# Altium schematic sheet obc-v2_CM4-POWER.SchDoc
size 420 x 297 mm; SheetNumber: 21; SheetTotal: 23
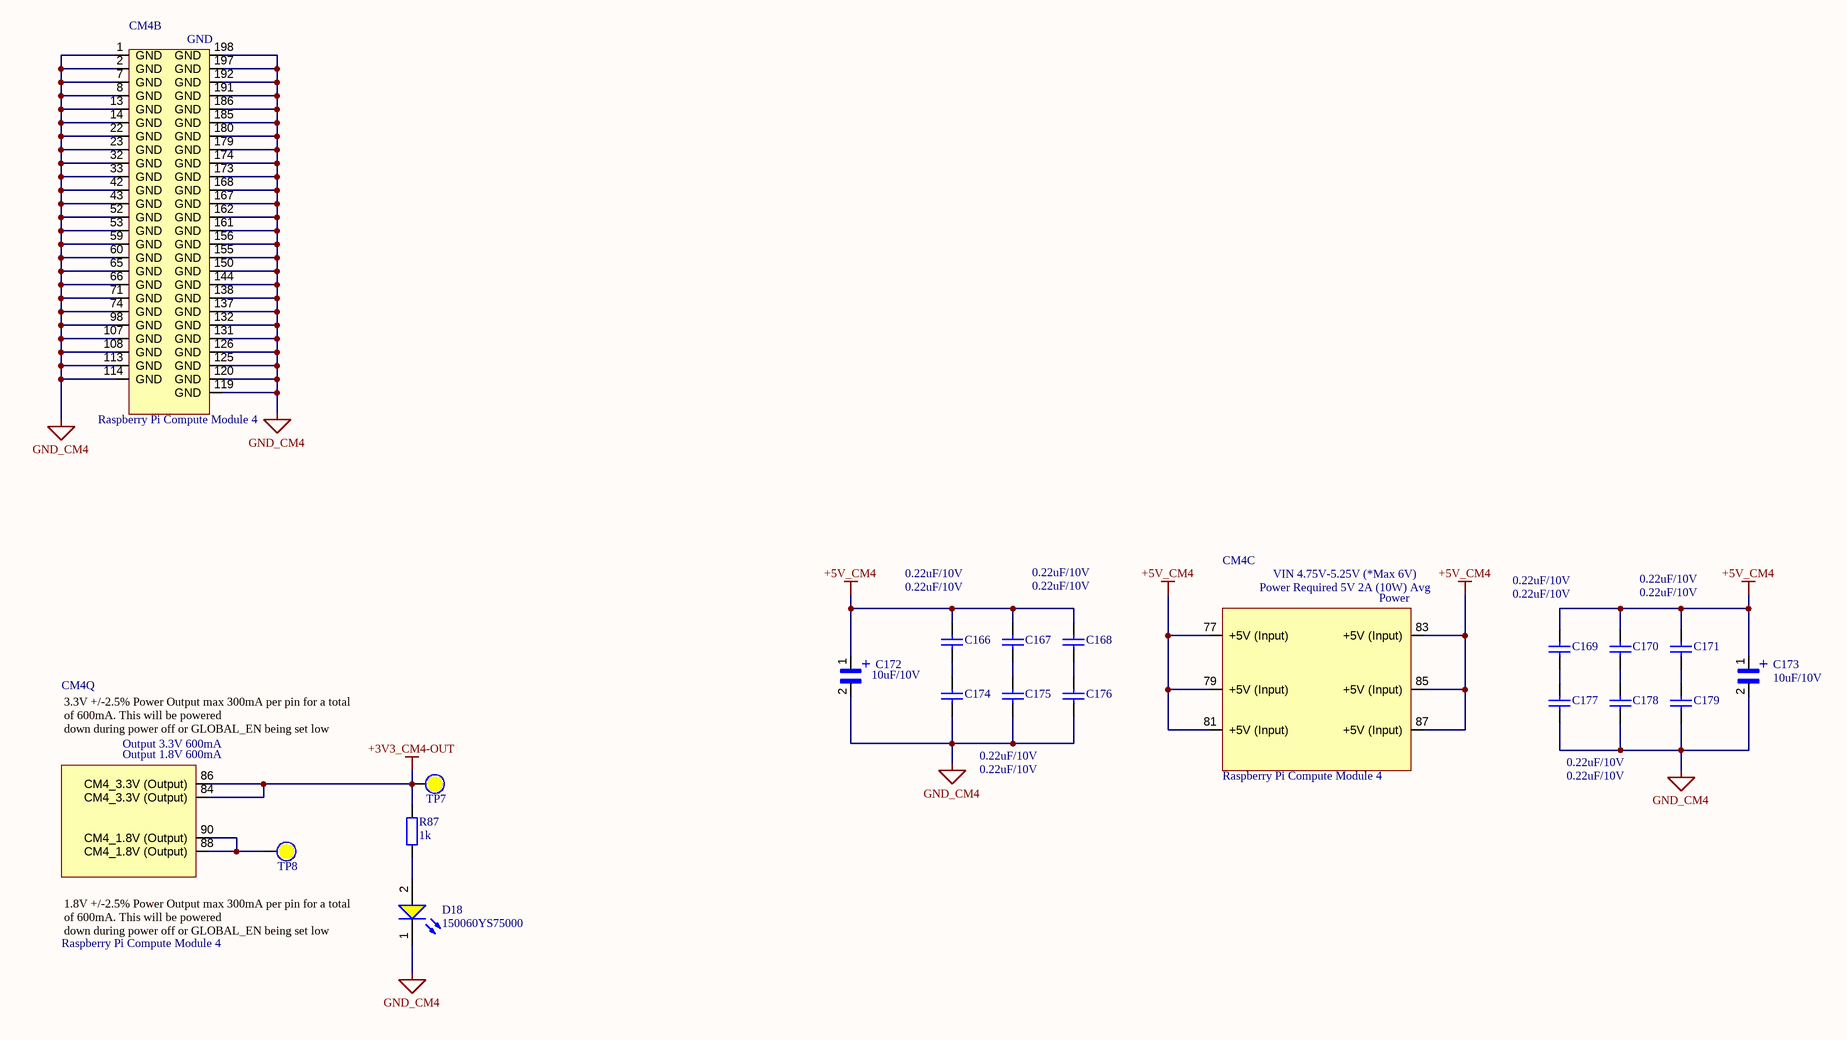
[diagram p0: obc-v2_CM4-POWER.SchDoc]

## Parts
C166  0.22uF/10V  [CAP_C_1005X60]
C167  0.22uF/10V  [CAP_C_1005X60]
C168  0.22uF/10V  [CAP_C_1005X60]
C169  0.22uF/10V  [CAP_C_1005X60]
C170  0.22uF/10V  [CAP_C_1005X60]
C171  0.22uF/10V  [CAP_C_1005X60]
C172  10uF/10V  [CAP_MP_2012X170]
C173  10uF/10V  [CAP_MP_2012X170]
C174  0.22uF/10V  [CAP_C_1005X60]
C175  0.22uF/10V  [CAP_C_1005X60]
C176  0.22uF/10V  [CAP_C_1005X60]
C177  0.22uF/10V  [CAP_C_1005X60]
C178  0.22uF/10V  [CAP_C_1005X60]
C179  0.22uF/10V  [CAP_C_1005X60]
CM4  Raspberry Pi Compute Module 4  [CM4-DF40HC(3.0)-100DS-0.4v_3mm_1.5mm]  (parts B,C,Q of 21)  (no BOM)
D18  150060YS75000  [WL-SMCW_0603_150060xx75000]
R87  1k  [RES_C_1608X60]
TP7  (no value)  [Test Point 1 Side]  (no BOM)
TP8  (no value)  [Test Point 1 Side]  (no BOM)

## Nets
+3V3_CM4-OUT: CM4.84(CM4_3.3V_(Output)) CM4.86(CM4_3.3V_(Output)) R87.2 TP7.0
+5V_CM4: C166.1 C167.1 C168.1 C169.1 C170.1 C171.1 C172.1 C173.1 CM4.77(+5V_(Input)) CM4.79(+5V_(Input)) CM4.81(+5V_(Input)) CM4.83(+5V_(Input)) CM4.85(+5V_(Input)) CM4.87(+5V_(Input))
GND_CM4: C172.2 C173.2 C174.2 C175.2 C176.2 C177.2 C178.2 C179.2 CM4.1(GND) CM4.2(GND) CM4.7(GND) CM4.8(GND) CM4.13(GND) CM4.14(GND) CM4.22(GND) CM4.23(GND) CM4.32(GND) CM4.33(GND) CM4.42(GND) CM4.43(GND) CM4.52(GND) CM4.53(GND) CM4.59(GND) CM4.60(GND) CM4.65(GND) CM4.66(GND) CM4.71(GND) CM4.74(GND) CM4.98(GND) CM4.107(GND) CM4.108(GND) CM4.113(GND) CM4.114(GND) CM4.119(GND) CM4.120(GND) CM4.125(GND) CM4.126(GND) CM4.131(GND) CM4.132(GND) CM4.137(GND) CM4.138(GND) CM4.144(GND) CM4.150(GND) CM4.155(GND) CM4.156(GND) CM4.161(GND) CM4.162(GND) CM4.167(GND) CM4.168(GND) CM4.173(GND) CM4.174(GND) CM4.179(GND) CM4.180(GND) CM4.185(GND) CM4.186(GND) CM4.191(GND) CM4.192(GND) CM4.197(GND) CM4.198(GND) D18.1(K)
NetC166_2: C166.2 C174.1
NetC167_2: C167.2 C175.1
NetC168_2: C168.2 C176.1
NetC169_2: C169.2 C177.1
NetC170_2: C170.2 C178.1
NetC171_2: C171.2 C179.1
NetCM4_88: CM4.88(CM4_1.8V_(Output)) CM4.90(CM4_1.8V_(Output)) TP8.0
NetD18_2: D18.2(A) R87.1

## Notes on the sheet
- Project:
- Sub-system:
- Design by:
- Sheet title:
- Sheet
- A3
- of
- Checked by:
- Approved by:
- Revision:
- Document No:
- Size:
- Date:
- (in symbol CM4, part C) VIN 4.75V-5.25V (*Max 6V); Power Required 5V 2A (10W) Avg; Power; by Amornthep Phunsin
- (in symbol CM4, part Q) 3.3V +/-2.5% Power Output max 300mA per pin for a total of 600mA. This will be powered / down during power off or GLOBAL_EN being set low; Output 3.3V 600mA; Output 1.8V 600mA; 1.8V +/-2.5% Power Output max 300mA per pin for a total of 600mA. This will be powered / down during power off or GLOBAL_EN being set low
- (in symbol TACR686M003RTA) +

## Library data of the parts
C166-C171 C174-C179 = Tu 0402 33nF 10V: CAPC; Chung_Loai: Dán; Don_Vi: Con; So_Chan: 2; Ten_Linh_Kien: Tụ 0402 33nF X7R 10V GRM155R71A333KA01D; Ma_Hang: MH007853; Kieu_Chan: *
C172 C173 = TACR686M003RTA: CAPP; MF: AVX; Availability: Unavailable; SnapEDA_Link: https://www.snapeda.com/parts/TACR686M003RTA/AVX/view-part/1745975/?ref=snap; MP: TACR686M003RTA; Value: *; Price: None; Package: 0805 AVX
CM4 = CM4: Raspberry Pi Compute Module 4 by Amornthep Phunsin
D18 = CMP-1426-00005-2: LED YELLOW CLEAR 0603 SMD; NexarPartId: 29687085; Wavelength: 590nm; Luminous Intensity: 120mcd; Peak Wavelength: 595nm; Forward Current: 100mA; Power Dissipation: 72mW; Forward Voltage: 2V; Test Current: 20mA; Reverse Voltage: 5V; Lens Style: Clear, Rectangular; Max Junction Temperature (Tj): 95°C; Viewing Angle: 140°; Case Code (Imperial): 0603; Height: 700µm; REACH SVHC: Unknown; Dominant Wavelength: 590nm; Min Operating Temperature: -40°C; Color: Yellow; Width: 800µm; Mount: Surface Mount; Packaging: Tape and Reel; Max Operating Temperature: 85°C; RoHS: Compliant; Max Reverse Voltage (DC): 5V; Case Code (Metric): 1608; Length: 1.6mm; Case/Package: 0603
R87 = Tro 0603 1% 10k: RES; Chung_Loai: Dán; Don_Vi: Con; So_Chan: 2; Ten_Linh_Kien: Trở 0603 1% 10k; Ma_Hang: MH006333; Kieu_Chan: *
TP7 TP8 = Test Point: Solder: NF